# EAGLE schematic module_core_2 (EAGLE 5.10)
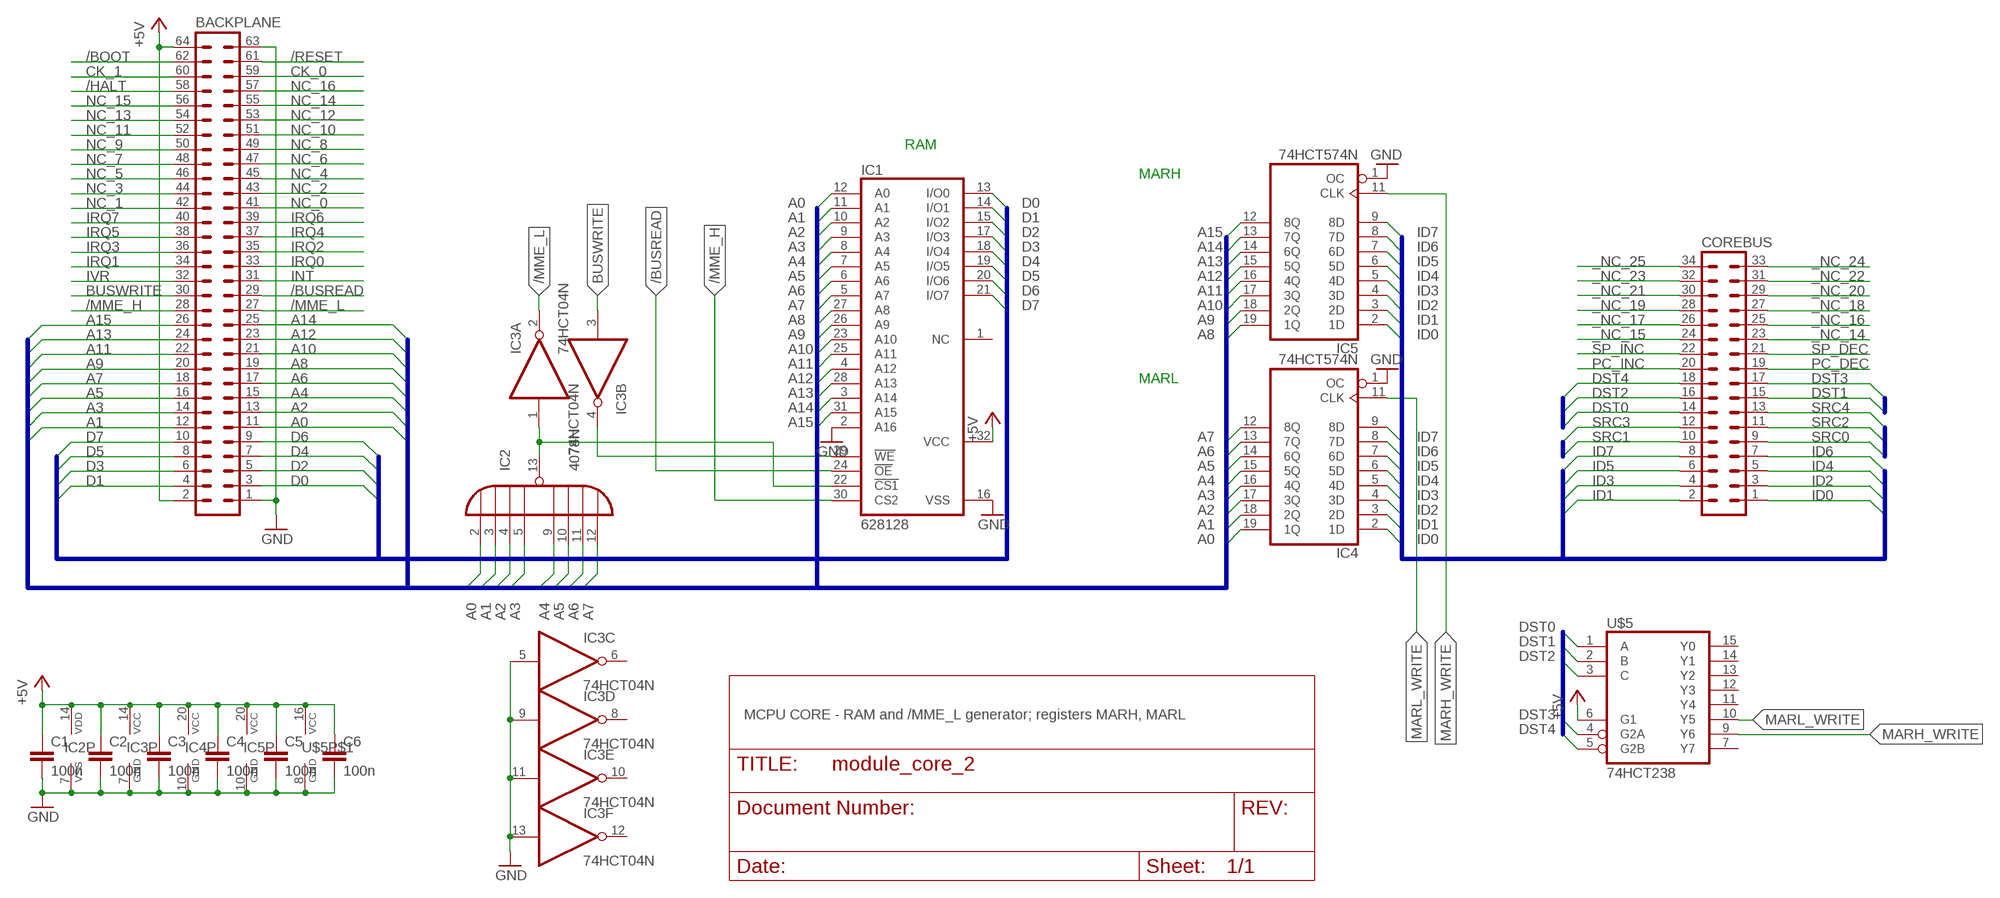
[diagram p0: schematic, sheet 1]

## Parts
BACKPLANE  ML64L  [ML64L]
C1  100n  C-EUC1206  [C1206]
C2  100n  C-EUC1206  [C1206]
C3  100n  C-EUC1206  [C1206]
C4  100n  C-EUC1206  [C1206]
C5  100n  C-EUC1206  [C1206]
C6  100n  C-EUC1206  [C1206]
COREBUS  ML34L  [ML34L]
IC1  628128  628128P  [DIL32]
IC2  4078N  [DIL14]
IC3  74HCT04N  [DIL14]
IC4  74HCT574N  [DIL20]
IC5  74HCT574N  [DIL20]
U$5  74HCT238  [DIL16]

## Nets
+5V: BACKPLANE.2 BACKPLANE.64 C1.1 C2.1 C3.1 C4.1 C5.1 C6.1 IC1.32(VCC) IC2.14(VDD) IC3.14(P:VCC) IC4.20(VCC) IC5.20(VCC) U$5.6(G1) U$5.16(VCC)
/BOOT: BACKPLANE.62
/BUSREAD: BACKPLANE.29 IC1.24(!OE)
/HALT: BACKPLANE.58
/MME_H: BACKPLANE.28 IC1.30(CS2)
/MME_L: BACKPLANE.27 IC3.2(A:O)
/RESET: BACKPLANE.61
_NC_14: COREBUS.23
_NC_15: COREBUS.24
_NC_16: COREBUS.25
_NC_17: COREBUS.26
_NC_18: COREBUS.27
_NC_19: COREBUS.28
_NC_20: COREBUS.29
_NC_21: COREBUS.30
_NC_22: COREBUS.31
_NC_23: COREBUS.32
_NC_24: COREBUS.33
_NC_25: COREBUS.34
A0: BACKPLANE.11 IC1.12(A0) IC2.2(I0) IC4.19(1Q)
A1: BACKPLANE.12 IC1.11(A1) IC2.3(I1) IC4.18(2Q)
A2: BACKPLANE.13 IC1.10(A2) IC2.4(I2) IC4.17(3Q)
A3: BACKPLANE.14 IC1.9(A3) IC2.5(I3) IC4.16(4Q)
A4: BACKPLANE.15 IC1.8(A4) IC2.9(I4) IC4.15(5Q)
A5: BACKPLANE.16 IC1.7(A5) IC2.10(I5) IC4.14(6Q)
A6: BACKPLANE.17 IC1.6(A6) IC2.11(I6) IC4.13(7Q)
A7: BACKPLANE.18 IC1.5(A7) IC2.12(I7) IC4.12(8Q)
A8: BACKPLANE.19 IC1.27(A8) IC5.19(1Q)
A9: BACKPLANE.20 IC1.26(A9) IC5.18(2Q)
A10: BACKPLANE.21 IC1.23(A10) IC5.17(3Q)
A11: BACKPLANE.22 IC1.25(A11) IC5.16(4Q)
A12: BACKPLANE.23 IC1.4(A12) IC5.15(5Q)
A13: BACKPLANE.24 IC1.28(A13) IC5.14(6Q)
A14: BACKPLANE.25 IC1.3(A14) IC5.13(7Q)
A15: BACKPLANE.26 IC1.31(A15) IC5.12(8Q)
BUSWRITE: BACKPLANE.30 IC3.3(B:I)
CK_0: BACKPLANE.59
CK_1: BACKPLANE.60
D0: BACKPLANE.3 IC1.13(I/O0)
D1: BACKPLANE.4 IC1.14(I/O1)
D2: BACKPLANE.5 IC1.15(I/O2)
D3: BACKPLANE.6 IC1.17(I/O3)
D4: BACKPLANE.7 IC1.18(I/O4)
D5: BACKPLANE.8 IC1.19(I/O5)
D6: BACKPLANE.9 IC1.20(I/O6)
D7: BACKPLANE.10 IC1.21(I/O7)
DST0: COREBUS.14 U$5.1(A)
DST1: COREBUS.15 U$5.2(B)
DST2: COREBUS.16 U$5.3(C)
DST3: COREBUS.17 U$5.4(G2A)
DST4: COREBUS.18 U$5.5(G2B)
GND: BACKPLANE.1 BACKPLANE.63 C1.2 C2.2 C3.2 C4.2 C5.2 C6.2 IC1.2(A16) IC1.16(VSS) IC2.7(VSS) IC3.5(C:I) IC3.7(P:GND) IC3.9(D:I) IC3.11(E:I) IC3.13(F:I) IC4.1(OC) IC4.10(GND) IC5.1(OC) IC5.10(GND) U$5.8(GND)
ID0: COREBUS.1 IC4.2(1D) IC5.2(1D)
ID1: COREBUS.2 IC4.3(2D) IC5.3(2D)
ID2: COREBUS.3 IC4.4(3D) IC5.4(3D)
ID3: COREBUS.4 IC4.5(4D) IC5.5(4D)
ID4: COREBUS.5 IC4.6(5D) IC5.6(5D)
ID5: COREBUS.6 IC4.7(6D) IC5.7(6D)
ID6: COREBUS.7 IC4.8(7D) IC5.8(7D)
ID7: COREBUS.8 IC4.9(8D) IC5.9(8D)
INT: BACKPLANE.31
IRQ0: BACKPLANE.33
IRQ1: BACKPLANE.34
IRQ2: BACKPLANE.35
IRQ3: BACKPLANE.36
IRQ4: BACKPLANE.37
IRQ5: BACKPLANE.38
IRQ6: BACKPLANE.39
IRQ7: BACKPLANE.40
IVR: BACKPLANE.32
MARH_WRITE: IC5.11(CLK) U$5.9(Y6)
MARL_WRITE: IC4.11(CLK) U$5.10(Y5)
N$1: IC1.22(!CS1) IC2.13(J) IC3.1(A:I)
N$3: IC1.29(!WE) IC3.4(B:O)
NC_0: BACKPLANE.41
NC_1: BACKPLANE.42
NC_2: BACKPLANE.43
NC_3: BACKPLANE.44
NC_4: BACKPLANE.45
NC_5: BACKPLANE.46
NC_6: BACKPLANE.47
NC_7: BACKPLANE.48
NC_8: BACKPLANE.49
NC_9: BACKPLANE.50
NC_10: BACKPLANE.51
NC_11: BACKPLANE.52
NC_12: BACKPLANE.53
NC_13: BACKPLANE.54
NC_14: BACKPLANE.55
NC_15: BACKPLANE.56
NC_16: BACKPLANE.57
PC_DEC: COREBUS.19
PC_INC: COREBUS.20
SP_DEC: COREBUS.21
SP_INC: COREBUS.22
SRC0: COREBUS.9
SRC1: COREBUS.10
SRC2: COREBUS.11
SRC3: COREBUS.12
SRC4: COREBUS.13
Unconnected: IC1.1(NC) IC3.6(C:O) IC3.8(D:O) IC3.10(E:O) IC3.12(F:O) U$5.7(Y7) U$5.11(Y4) U$5.12(Y3) U$5.13(Y2) U$5.14(Y1) U$5.15(Y0)

## Buses
D[0..7]
A[0..15]
ID[0..7]
DST[0..4]
SRC[0..4]

## Notes on the sheet
- RAM
- MARH
- MARL
- MCPU CORE - RAM and /MME_L generator; registers MARH, MARL

## Library data of the parts
BACKPLANE = con-ml:ML64L: HARTING
C1-C6 = rcl:C-EU: CAPACITOR, European symbol
COREBUS = con-ml:ML34L: HARTING
IC1 = memory-hitachi:628128P: MEMORY
IC2 = 40xx:4078: 8-input NOR
IC3 = 74xx-eu:74*04: Hex INVERTER
IC4 IC5 = 74xx-eu:74*574: 8-bit D type FLIP FLOP bus driver
U$5 = 74xx-eu:74*238: 3 TO 8 LINE DECODER (DEMULTIPLEXER)

## Net classes
0 Signal: width 0.305 mm, drill 0.508 mm, clearance 0.203 mm
1 LoVolt42: width 0.61 mm, drill 0.508 mm, clearance 0.813 mm to class 0, clearance 0.305 mm
2 MedVolt100: width 0.61 mm, drill 0.508 mm, clearance 1.626 mm to class 0, clearance 1.626 mm to class 1, clearance 0.813 mm
3 LineVolt350: width 0.813 mm, drill 0.508 mm, clearance 12.7 mm to class 0, clearance 12.7 mm to class 1, clearance 12.7 mm to class 2, clearance 2.54 mm